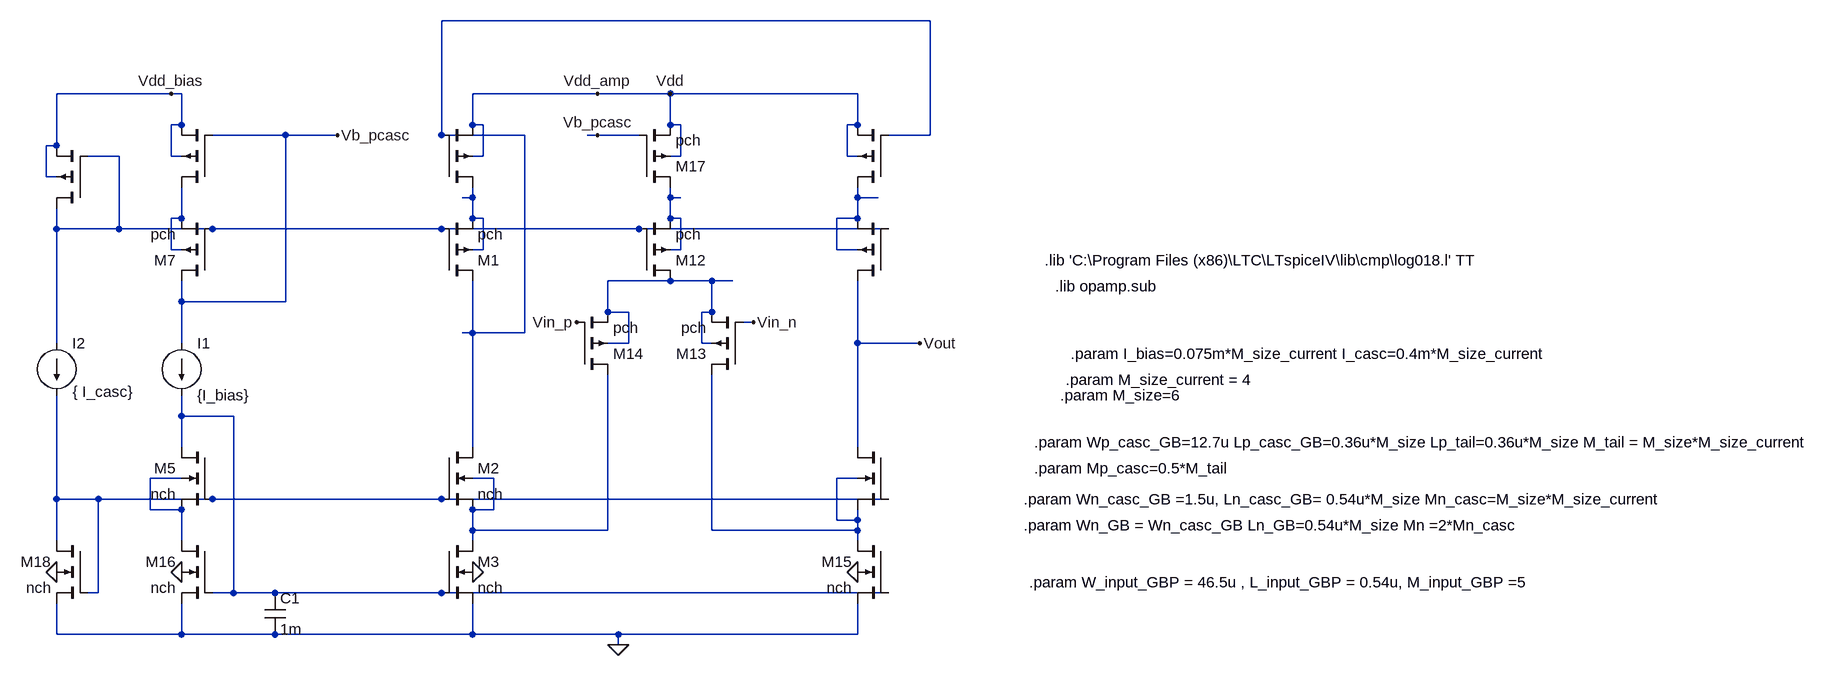
[diagram p0: schematic GB-PMOS.asc]
GB-PMOS.asc, the LTspice schematic file:
Version 4
SHEET 1 3836 784
WIRE 2000 -1008 1248 -1008
WIRE 832 -896 656 -896
WIRE 848 -896 832 -896
WIRE 1488 -896 1296 -896
WIRE 1600 -896 1488 -896
WIRE 1792 -896 1600 -896
WIRE 1888 -896 1792 -896
WIRE 848 -848 848 -896
WIRE 848 -848 832 -848
WIRE 1296 -848 1296 -896
WIRE 1312 -848 1296 -848
WIRE 1600 -848 1600 -896
WIRE 1616 -848 1600 -848
WIRE 1888 -848 1888 -896
WIRE 1888 -848 1872 -848
WIRE 976 -832 896 -832
WIRE 1008 -832 976 -832
WIRE 1088 -832 1008 -832
WIRE 1248 -832 1248 -1008
WIRE 1376 -832 1248 -832
WIRE 1488 -832 1472 -832
WIRE 1552 -832 1488 -832
WIRE 2000 -832 2000 -1008
WIRE 2000 -832 1936 -832
WIRE 656 -816 656 -896
WIRE 656 -816 640 -816
WIRE 752 -800 704 -800
WIRE 832 -800 832 -848
WIRE 848 -800 832 -800
WIRE 1312 -800 1312 -848
WIRE 1312 -800 1296 -800
WIRE 1616 -800 1616 -848
WIRE 1616 -800 1600 -800
WIRE 1872 -800 1872 -848
WIRE 1888 -800 1872 -800
WIRE 640 -768 640 -816
WIRE 656 -768 640 -768
WIRE 1296 -736 1296 -752
WIRE 1296 -736 1280 -736
WIRE 1600 -736 1600 -752
WIRE 1616 -736 1600 -736
WIRE 1888 -736 1888 -752
WIRE 1920 -736 1888 -736
WIRE 848 -704 848 -752
WIRE 848 -704 832 -704
WIRE 1296 -704 1296 -736
WIRE 1312 -704 1296 -704
WIRE 1600 -704 1600 -736
WIRE 1616 -704 1600 -704
WIRE 1888 -704 1888 -736
WIRE 1888 -704 1856 -704
WIRE 656 -688 656 -720
WIRE 752 -688 752 -800
WIRE 752 -688 656 -688
WIRE 896 -688 752 -688
WIRE 1104 -688 896 -688
WIRE 1248 -688 1104 -688
WIRE 1552 -688 1248 -688
WIRE 1936 -688 1552 -688
WIRE 832 -656 832 -704
WIRE 848 -656 832 -656
WIRE 1312 -656 1312 -704
WIRE 1312 -656 1296 -656
WIRE 1616 -656 1616 -704
WIRE 1616 -656 1600 -656
WIRE 1856 -656 1856 -704
WIRE 1888 -656 1856 -656
WIRE 1600 -608 1504 -608
WIRE 1664 -608 1600 -608
WIRE 1696 -608 1664 -608
WIRE 848 -576 848 -608
WIRE 1008 -576 1008 -832
WIRE 1008 -576 848 -576
WIRE 1504 -560 1504 -608
WIRE 1536 -560 1504 -560
WIRE 1664 -560 1664 -608
WIRE 1664 -560 1648 -560
WIRE 1728 -544 1712 -544
WIRE 1296 -528 1296 -608
WIRE 1296 -528 1280 -528
WIRE 1376 -528 1376 -832
WIRE 1376 -528 1296 -528
WIRE 656 -512 656 -688
WIRE 848 -512 848 -576
WIRE 1536 -512 1536 -560
WIRE 1536 -512 1504 -512
WIRE 1648 -512 1648 -560
WIRE 1664 -512 1648 -512
WIRE 1888 -512 1888 -608
WIRE 1952 -512 1888 -512
WIRE 1984 -512 1952 -512
WIRE 1296 -416 1296 -528
WIRE 1504 -416 1504 -464
WIRE 1664 -416 1664 -464
WIRE 1888 -416 1888 -512
WIRE 848 -400 848 -432
WIRE 928 -400 848 -400
WIRE 848 -352 848 -400
WIRE 1296 -352 1296 -416
WIRE 1888 -352 1888 -416
WIRE 848 -304 800 -304
WIRE 1328 -304 1296 -304
WIRE 1888 -304 1856 -304
WIRE 656 -272 656 -432
WIRE 720 -272 656 -272
WIRE 896 -272 720 -272
WIRE 1056 -272 896 -272
WIRE 1248 -272 1056 -272
WIRE 1936 -272 1248 -272
WIRE 800 -256 800 -304
WIRE 848 -256 800 -256
WIRE 1328 -256 1328 -304
WIRE 1328 -256 1296 -256
WIRE 1856 -240 1856 -304
WIRE 1888 -240 1888 -256
WIRE 1888 -240 1856 -240
WIRE 1296 -224 1296 -256
WIRE 1376 -224 1296 -224
WIRE 1504 -224 1504 -416
WIRE 1504 -224 1376 -224
WIRE 1664 -224 1664 -416
WIRE 1808 -224 1664 -224
WIRE 1888 -224 1888 -240
WIRE 1888 -224 1808 -224
WIRE 656 -208 656 -272
WIRE 848 -208 848 -256
WIRE 1296 -208 1296 -224
WIRE 1888 -208 1888 -224
WIRE 720 -128 720 -272
WIRE 720 -128 704 -128
WIRE 928 -128 928 -400
WIRE 928 -128 896 -128
WIRE 992 -128 928 -128
WIRE 1088 -128 992 -128
WIRE 1248 -128 1088 -128
WIRE 1936 -128 1248 -128
WIRE 656 -64 656 -112
WIRE 848 -64 848 -112
WIRE 848 -64 656 -64
WIRE 992 -64 848 -64
WIRE 1296 -64 1296 -112
WIRE 1296 -64 992 -64
WIRE 1520 -64 1296 -64
WIRE 1888 -64 1888 -112
WIRE 1888 -64 1520 -64
WIRE 1520 -48 1520 -64
FLAG 1296 -160 0
FLAG 1488 -896 Vdd_amp
FLAG 848 -160 0
FLAG 656 -160 0
FLAG 1888 -160 0
FLAG 1520 -48 0
FLAG 1984 -512 Vout
FLAG 1456 -544 Vin_p
FLAG 1728 -544 Vin_n
FLAG 1088 -832 Vb_pcasc
FLAG 1488 -832 Vb_pcasc
FLAG 832 -896 Vdd_bias
FLAG 1600 -896 Vdd
DATAFLAG 1376 -224 "round($*10k)/10k"
DATAFLAG 1808 -224 "round($*10k)/10k"
DATAFLAG 1792 -896 "round($*1k)/1k"
DATAFLAG 1664 -416 "round(-Id(x6:x3:M3)*10000000)/10000000"
DATAFLAG 1616 -736 "round($*100)/100"
DATAFLAG 1920 -736 "round($*100)/100"
DATAFLAG 1280 -736 "round($*100)/100"
DATAFLAG 1104 -688 "round($*100)/100"
DATAFLAG 976 -832 "round($*100)/100"
DATAFLAG 1056 -272 "round($*100)/100"
DATAFLAG 1088 -128 "round($*100)/100"
DATAFLAG 1280 -528 "round($*100)/100"
DATAFLAG 1952 -512 "round($*100)/100"
DATAFLAG 1696 -608 "round($*100)/100"
DATAFLAG 1296 -416 "round(Id(M11)*10000K)/10000K"
DATAFLAG 1888 -416 "round(Id(x6:x3:M7)*10000000)/10000000"
DATAFLAG 1504 -416 "round(Id(M18)*10000K)/10000K"
SYMBOL pmos4 1248 -608 M180
SYMATTR InstName M1
SYMATTR Value pch
SYMATTR Value2 l={Lp_casc_GB} w={Wp_casc_GB} m={Mp_casc}
SYMBOL nmos4 1248 -352 R0
SYMATTR InstName M2
SYMATTR Value nch
SYMATTR Value2 l={Ln_casc_GB} w={Wn_casc_GB} m={Mn_casc}
SYMBOL nmos4 1248 -208 R0
SYMATTR InstName M3
SYMATTR Value nch
SYMATTR Value2 l={Ln_casc_GB} w={Wn_GB} m={Mn}
SYMBOL pmos4 1248 -752 M180
WINDOW 0 56 32 Invisible 2
WINDOW 3 56 72 Invisible 2
SYMATTR InstName M4
SYMATTR Value pch
SYMATTR Value2 l={Lp_casc_GB} w={Wp_casc_GB} m={Mp_casc}
SYMBOL current 848 -512 R0
WINDOW 123 0 0 Left 2
WINDOW 39 0 0 Left 2
SYMATTR InstName I1
SYMATTR Value {I_bias}
SYMBOL nmos4 896 -352 M0
SYMATTR InstName M5
SYMATTR Value nch
SYMATTR Value2 l={Ln_casc_GB} w={Wn_casc_GB} m={Mn_casc}
SYMBOL current 656 -512 R0
WINDOW 123 0 0 Left 2
WINDOW 39 0 0 Left 2
WINDOW 3 25 75 Left 2
SYMATTR Value { I_casc}
SYMATTR InstName I2
SYMBOL pmos4 896 -752 R180
WINDOW 0 56 32 Invisible 2
WINDOW 3 56 72 Invisible 2
SYMATTR InstName M6
SYMATTR Value pch
SYMATTR Value2 l={Lp_casc_GB} w={Wp_casc_GB} m={M_tail}
SYMBOL pmos4 896 -608 R180
SYMATTR InstName M7
SYMATTR Value pch
SYMATTR Value2 l={Lp_casc_GB} w={Wp_casc_GB} m={M_tail}
SYMBOL pmos4 704 -720 R180
WINDOW 0 56 32 Invisible 2
WINDOW 3 56 72 Invisible 2
SYMATTR InstName M8
SYMATTR Value pch
SYMATTR Value2 l={Lp_casc_GB} w={Wp_casc_GB} m={M_tail}
SYMBOL pmos4 1936 -608 R180
WINDOW 0 56 32 Invisible 2
WINDOW 3 56 72 Invisible 2
SYMATTR InstName M9
SYMATTR Value pch
SYMATTR Value2 l={Lp_casc_GB} w={Wp_casc_GB} m={Mp_casc}
SYMBOL nmos4 1936 -352 M0
WINDOW 0 56 32 Invisible 2
WINDOW 3 56 72 Invisible 2
SYMATTR InstName M10
SYMATTR Value nch
SYMATTR Value2 l={Ln_casc_GB} w={Wn_casc_GB} m={Mn_casc}
SYMBOL pmos4 1936 -752 R180
WINDOW 0 56 32 Invisible 2
WINDOW 3 56 72 Invisible 2
SYMATTR InstName M11
SYMATTR Value pch
SYMATTR Value2 l={Lp_casc_GB} w={Wp_casc_GB} m={Mp_casc}
SYMBOL pmos4 1552 -608 M180
SYMATTR InstName M12
SYMATTR Value pch
SYMATTR Value2 l={Lp_tail} w={Wp_casc_GB} m={M_tail}
SYMBOL pmos4 1712 -464 R180
SYMATTR InstName M13
SYMATTR Value pch
SYMATTR Value2 l={L_input_GBP} w={W_input_GBP} m={M_input_GBP}
SYMBOL pmos4 1456 -464 M180
SYMATTR InstName M14
SYMATTR Value pch
SYMATTR Value2 l={L_input_GBP} w={W_input_GBP} m={M_input_GBP}
SYMBOL cap 976 -128 R0
SYMATTR InstName C1
SYMATTR Value 1m
SYMBOL nmos4 1936 -208 M0
SYMATTR InstName M15
SYMATTR Value nch
SYMATTR Value2 l={Ln_casc_GB} w={Wn_GB} m={Mn}
SYMBOL nmos4 896 -208 M0
SYMATTR InstName M16
SYMATTR Value nch
SYMATTR Value2 l={Ln_casc_GB} w={Wn_GB} m={Mn}
SYMBOL pmos4 1552 -752 M180
SYMATTR InstName M17
SYMATTR Value pch
SYMATTR Value2 l={Lp_tail} w={Wp_casc_GB} m={M_tail}
SYMBOL nmos4 704 -208 M0
SYMATTR InstName M18
SYMATTR Value nch
SYMATTR Value2 l={Ln_casc_GB} w={Wn_GB} m={Mn}
TEXT 2176 -640 Left 2 !.lib 'C:\\Program Files (x86)\\LTC\\LTspiceIV\\lib\\cmp\\log018.l' TT
TEXT 2192 -600 Left 2 !.lib opamp.sub
TEXT 2160 -360 Left 2 !.param Wp_casc_GB=12.7u Lp_casc_GB=0.36u*M_size Lp_tail=0.36u*M_size M_tail = M_size*M_size_current
TEXT 2144 -272 Left 2 !.param Wn_casc_GB =1.5u, Ln_casc_GB= 0.54u*M_size Mn_casc=M_size*M_size_current
TEXT 2144 -232 Left 2 !.param Wn_GB = Wn_casc_GB Ln_GB=0.54u*M_size Mn =2*Mn_casc
TEXT 2152 -144 Left 2 !.param W_input_GBP = 46.5u , L_input_GBP = 0.54u, M_input_GBP =5
TEXT 2200 -432 Left 2 !.param M_size=6
TEXT 2160 -320 Left 2 !.param Mp_casc=0.5*M_tail
TEXT 2208 -456 Left 2 !.param M_size_current = 4
TEXT 2216 -496 Left 2 !.param I_bias=0.075m*M_size_current I_casc=0.4m*M_size_current

The netlist it stands for:
* GB-PMOS.asc
M1 N001 N002 N003 N003 pch l={Lp_casc_GB} w={Wp_casc_GB} m={Mp_casc}
M2 N001 N012 N008 N008 nch l={Ln_casc_GB} w={Wn_casc_GB} m={Mn_casc}
M3 N008 N010 0 0 nch l={Ln_casc_GB} w={Wn_GB} m={Mn}
M4 N003 N001 Vdd Vdd pch l={Lp_casc_GB} w={Wp_casc_GB} m={Mp_casc}
I1 Vb_pcasc N010 {I_bias}
M5 N010 N012 N011 N011 nch l={Ln_casc_GB} w={Wn_casc_GB} m={Mn_casc}
I2 N002 N012 { I_casc}
M6 N006 Vb_pcasc Vdd_bias Vdd_bias pch l={Lp_casc_GB} w={Wp_casc_GB} m={M_tail}
M7 Vb_pcasc N002 N006 N006 pch l={Lp_casc_GB} w={Wp_casc_GB} m={M_tail}
M8 N002 N002 Vdd_bias Vdd_bias pch l={Lp_casc_GB} w={Wp_casc_GB} m={M_tail}
M9 Vout N002 N005 N005 pch l={Lp_casc_GB} w={Wp_casc_GB} m={Mp_casc}
M10 Vout N012 N009 N009 nch l={Ln_casc_GB} w={Wn_casc_GB} m={Mn_casc}
M11 N005 N001 Vdd Vdd pch l={Lp_casc_GB} w={Wp_casc_GB} m={Mp_casc}
M12 N007 N002 N004 N004 pch l={Lp_tail} w={Wp_casc_GB} m={M_tail}
M13 N009 Vin_n N007 N007 pch l={L_input_GBP} w={W_input_GBP} m={M_input_GBP}
M14 N008 Vin_p N007 N007 pch l={L_input_GBP} w={W_input_GBP} m={M_input_GBP}
C1 N010 0 1m
M15 N009 N010 0 0 nch l={Ln_casc_GB} w={Wn_GB} m={Mn}
M16 N011 N010 0 0 nch l={Ln_casc_GB} w={Wn_GB} m={Mn}
M17 N004 Vb_pcasc Vdd Vdd pch l={Lp_tail} w={Wp_casc_GB} m={M_tail}
M18 N012 N012 0 0 nch l={Ln_casc_GB} w={Wn_GB} m={Mn}
.model NMOS NMOS
.model PMOS PMOS
.lib standard.mos
.lib 'C:\Program Files (x86)\LTC\LTspiceIV\lib\cmp\log018.l' TT
.lib opamp.sub
.param Wp_casc_GB=12.7u Lp_casc_GB=0.36u*M_size Lp_tail=0.36u*M_size M_tail = M_size*M_size_current
.param Wn_casc_GB =1.5u, Ln_casc_GB= 0.54u*M_size Mn_casc=M_size*M_size_current
.param Wn_GB = Wn_casc_GB Ln_GB=0.54u*M_size Mn =2*Mn_casc
.param W_input_GBP = 46.5u , L_input_GBP = 0.54u, M_input_GBP =5
.param M_size=6
.param Mp_casc=0.5*M_tail
.param M_size_current = 4
.param I_bias=0.075m*M_size_current I_casc=0.4m*M_size_current
.backanno
.end